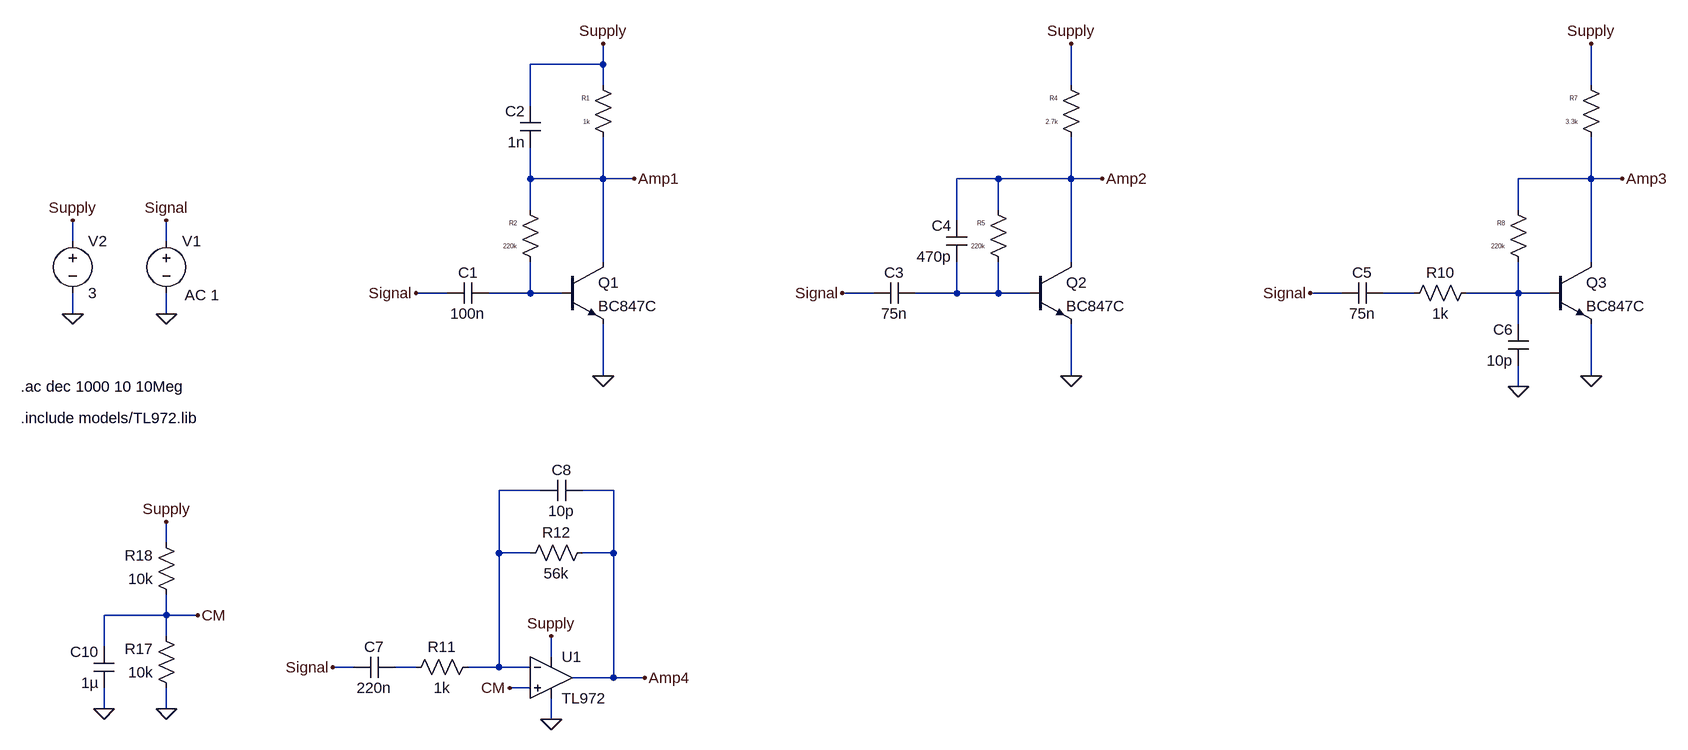
[diagram p0: schematic freq-response_single-stage.asc]
freq-response_single-stage.asc, the LTspice schematic file:
Version 4
SHEET 1 2272 1680
WIRE 560 144 560 112
WIRE 560 144 448 144
WIRE 560 176 560 144
WIRE 1280 176 1280 112
WIRE 2080 176 2080 112
WIRE 448 208 448 144
WIRE 448 320 448 272
WIRE 560 320 560 256
WIRE 560 320 448 320
WIRE 608 320 560 320
WIRE 1168 320 1104 320
WIRE 1280 320 1280 256
WIRE 1280 320 1168 320
WIRE 1328 320 1280 320
WIRE 2080 320 2080 256
WIRE 2080 320 1968 320
WIRE 2128 320 2080 320
WIRE 448 368 448 320
WIRE 1168 368 1168 320
WIRE 1968 368 1968 320
WIRE 1104 384 1104 320
WIRE -256 416 -256 384
WIRE -112 416 -112 384
WIRE 560 448 560 320
WIRE 1280 448 1280 320
WIRE 2080 448 2080 320
WIRE 320 496 272 496
WIRE 448 496 448 448
WIRE 448 496 384 496
WIRE 496 496 448 496
WIRE 976 496 928 496
WIRE 1104 496 1104 448
WIRE 1104 496 1040 496
WIRE 1168 496 1168 448
WIRE 1168 496 1104 496
WIRE 1216 496 1168 496
WIRE 1696 496 1648 496
WIRE 1808 496 1760 496
WIRE 1968 496 1968 448
WIRE 1968 496 1888 496
WIRE 2016 496 1968 496
WIRE -256 528 -256 496
WIRE -112 528 -112 496
WIRE 1968 544 1968 496
WIRE 560 624 560 544
WIRE 1280 624 1280 544
WIRE 2080 624 2080 544
WIRE 1968 640 1968 608
WIRE 464 800 400 800
WIRE 576 800 528 800
WIRE -112 880 -112 848
WIRE 400 896 400 800
WIRE 448 896 400 896
WIRE 576 896 576 800
WIRE 576 896 528 896
WIRE -112 992 -112 960
WIRE -112 992 -208 992
WIRE -64 992 -112 992
WIRE -112 1024 -112 992
WIRE -208 1040 -208 992
WIRE 480 1056 480 1024
WIRE 176 1072 144 1072
WIRE 272 1072 240 1072
WIRE 400 1072 400 896
WIRE 400 1072 352 1072
WIRE 448 1072 400 1072
WIRE 576 1088 576 896
WIRE 576 1088 512 1088
WIRE 624 1088 576 1088
WIRE 448 1104 416 1104
WIRE -208 1136 -208 1104
WIRE -112 1136 -112 1104
WIRE 480 1152 480 1120
FLAG 560 624 0
FLAG 560 112 Supply
FLAG 608 320 Amp1
FLAG -112 528 0
FLAG -112 384 Signal
FLAG -256 384 Supply
FLAG -256 528 0
FLAG 272 496 Signal
FLAG 1280 624 0
FLAG 1280 112 Supply
FLAG 1328 320 Amp2
FLAG 928 496 Signal
FLAG 2080 624 0
FLAG 2080 112 Supply
FLAG 2128 320 Amp3
FLAG 1648 496 Signal
FLAG 1968 640 0
FLAG 480 1152 0
FLAG 480 1024 Supply
FLAG 416 1104 CM
FLAG -112 1136 0
FLAG -64 992 CM
FLAG -112 848 Supply
FLAG -208 1136 0
FLAG 144 1072 Signal
FLAG 624 1088 Amp4
SYMBOL res 576 272 R180
WINDOW 0 36 76 Left 0
WINDOW 3 36 40 Left 0
SYMATTR InstName R1
SYMATTR Value 1k
SYMBOL cap 384 480 R90
WINDOW 0 0 32 VBottom 2
WINDOW 3 32 32 VTop 2
SYMATTR InstName C1
SYMATTR Value 100n
SYMBOL npn 496 448 R0
SYMATTR InstName Q1
SYMATTR Value BC847C
SYMBOL res 464 464 R180
WINDOW 0 36 76 Left 0
WINDOW 3 36 40 Left 0
SYMATTR InstName R2
SYMATTR Value 220k
SYMBOL cap 464 272 R180
WINDOW 0 24 56 Left 2
WINDOW 3 24 8 Left 2
SYMATTR InstName C2
SYMATTR Value 1n
SYMBOL voltage -112 400 R0
WINDOW 123 28 99 Left 2
SYMATTR Value2 AC 1
SYMATTR InstName V1
SYMATTR Value ""
SYMBOL voltage -256 400 R0
SYMATTR InstName V2
SYMATTR Value 3
SYMBOL res 1296 272 R180
WINDOW 0 36 76 Left 0
WINDOW 3 36 40 Left 0
SYMATTR InstName R4
SYMATTR Value 2.7k
SYMBOL cap 1040 480 R90
WINDOW 0 0 32 VBottom 2
WINDOW 3 32 32 VTop 2
SYMATTR InstName C3
SYMATTR Value 75n
SYMBOL npn 1216 448 R0
SYMATTR InstName Q2
SYMATTR Value BC847C
SYMBOL res 1184 464 R180
WINDOW 0 36 76 Left 0
WINDOW 3 36 40 Left 0
SYMATTR InstName R5
SYMATTR Value 220k
SYMBOL cap 1120 448 R180
WINDOW 0 24 56 Left 2
WINDOW 3 24 8 Left 2
SYMATTR InstName C4
SYMATTR Value 470p
SYMBOL res 2096 272 R180
WINDOW 0 36 76 Left 0
WINDOW 3 36 40 Left 0
SYMATTR InstName R7
SYMATTR Value 3.3k
SYMBOL cap 1760 480 R90
WINDOW 0 0 32 VBottom 2
WINDOW 3 32 32 VTop 2
SYMATTR InstName C5
SYMATTR Value 75n
SYMBOL npn 2016 448 R0
SYMATTR InstName Q3
SYMATTR Value BC847C
SYMBOL res 1984 464 R180
WINDOW 0 36 76 Left 0
WINDOW 3 36 40 Left 0
SYMATTR InstName R8
SYMATTR Value 220k
SYMBOL cap 1984 608 R180
WINDOW 0 24 56 Left 2
WINDOW 3 24 8 Left 2
SYMATTR InstName C6
SYMATTR Value 10p
SYMBOL res 1792 512 R270
WINDOW 0 32 56 VTop 2
WINDOW 3 0 56 VBottom 2
SYMATTR InstName R10
SYMATTR Value 1k
SYMBOL res 368 1056 R90
WINDOW 0 0 56 VBottom 2
WINDOW 3 32 56 VTop 2
SYMATTR InstName R11
SYMATTR Value 1k
SYMBOL cap 240 1056 R90
WINDOW 0 0 32 VBottom 2
WINDOW 3 32 32 VTop 2
SYMATTR InstName C7
SYMATTR Value 220n
SYMBOL res 544 880 R90
WINDOW 0 0 56 VBottom 2
WINDOW 3 32 56 VTop 2
SYMATTR InstName R12
SYMATTR Value 56k
SYMBOL Opamps/opamp2 480 1024 R0
SYMATTR InstName U1
SYMATTR Value TL972
SYMBOL cap 528 784 R90
WINDOW 0 0 32 VBottom 2
WINDOW 3 32 32 VTop 2
SYMATTR InstName C8
SYMATTR Value 10p
SYMBOL res -96 1120 R180
WINDOW 0 36 76 Left 2
WINDOW 3 36 40 Left 2
SYMATTR InstName R17
SYMATTR Value 10k
SYMBOL res -96 976 R180
WINDOW 0 36 76 Left 2
WINDOW 3 36 40 Left 2
SYMATTR InstName R18
SYMATTR Value 10k
SYMBOL cap -192 1104 R180
WINDOW 0 24 56 Left 2
WINDOW 3 24 8 Left 2
SYMATTR InstName C10
SYMATTR Value 1µ
TEXT -336 640 Left 2 !.ac dec 1000 10 10Meg
TEXT -336 688 Left 2 !.include models/TL972.lib

The netlist it stands for:
* freq-response_single-stage.asc
R1 Amp1 Supply 1k
C1 N001 Signal 100n
Q1 Amp1 N001 0 0 BC847C
R2 N001 Amp1 220k
C2 Amp1 Supply 1n
V1 Signal 0 AC 1
V2 Supply 0 3
R4 Amp2 Supply 2.7k
C3 N002 Signal 75n
Q2 Amp2 N002 0 0 BC847C
R5 N002 Amp2 220k
C4 N002 Amp2 470p
R7 Amp3 Supply 3.3k
C5 N003 Signal 75n
Q3 Amp3 N004 0 0 BC847C
R8 N004 Amp3 220k
C6 0 N004 10p
R10 N003 N004 1k
R11 N005 N006 1k
C7 N006 Signal 220n
R12 Amp4 N005 56k
XU1 CM N005 Supply 0 Amp4 TL972  ; pins In+ In- V+ V- OUT
C8 Amp4 N005 10p
R17 0 CM 10k
R18 CM Supply 10k
C10 0 CM 1µ
.model NPN NPN
.model PNP PNP
.lib standard.bjt
.ac dec 1000 10 10Meg
.include models/TL972.lib
.backanno
.end